# Altium schematic sheet 2_USB_Serial.SchDoc
size A3; Organization: Altium Limited; Address1: L3, 12a Rodborough Rd; Address2: Frenchs Forest; Address3: NSW; Address4: Australia 2086; SheetNumber: 2; SheetTotal: 4
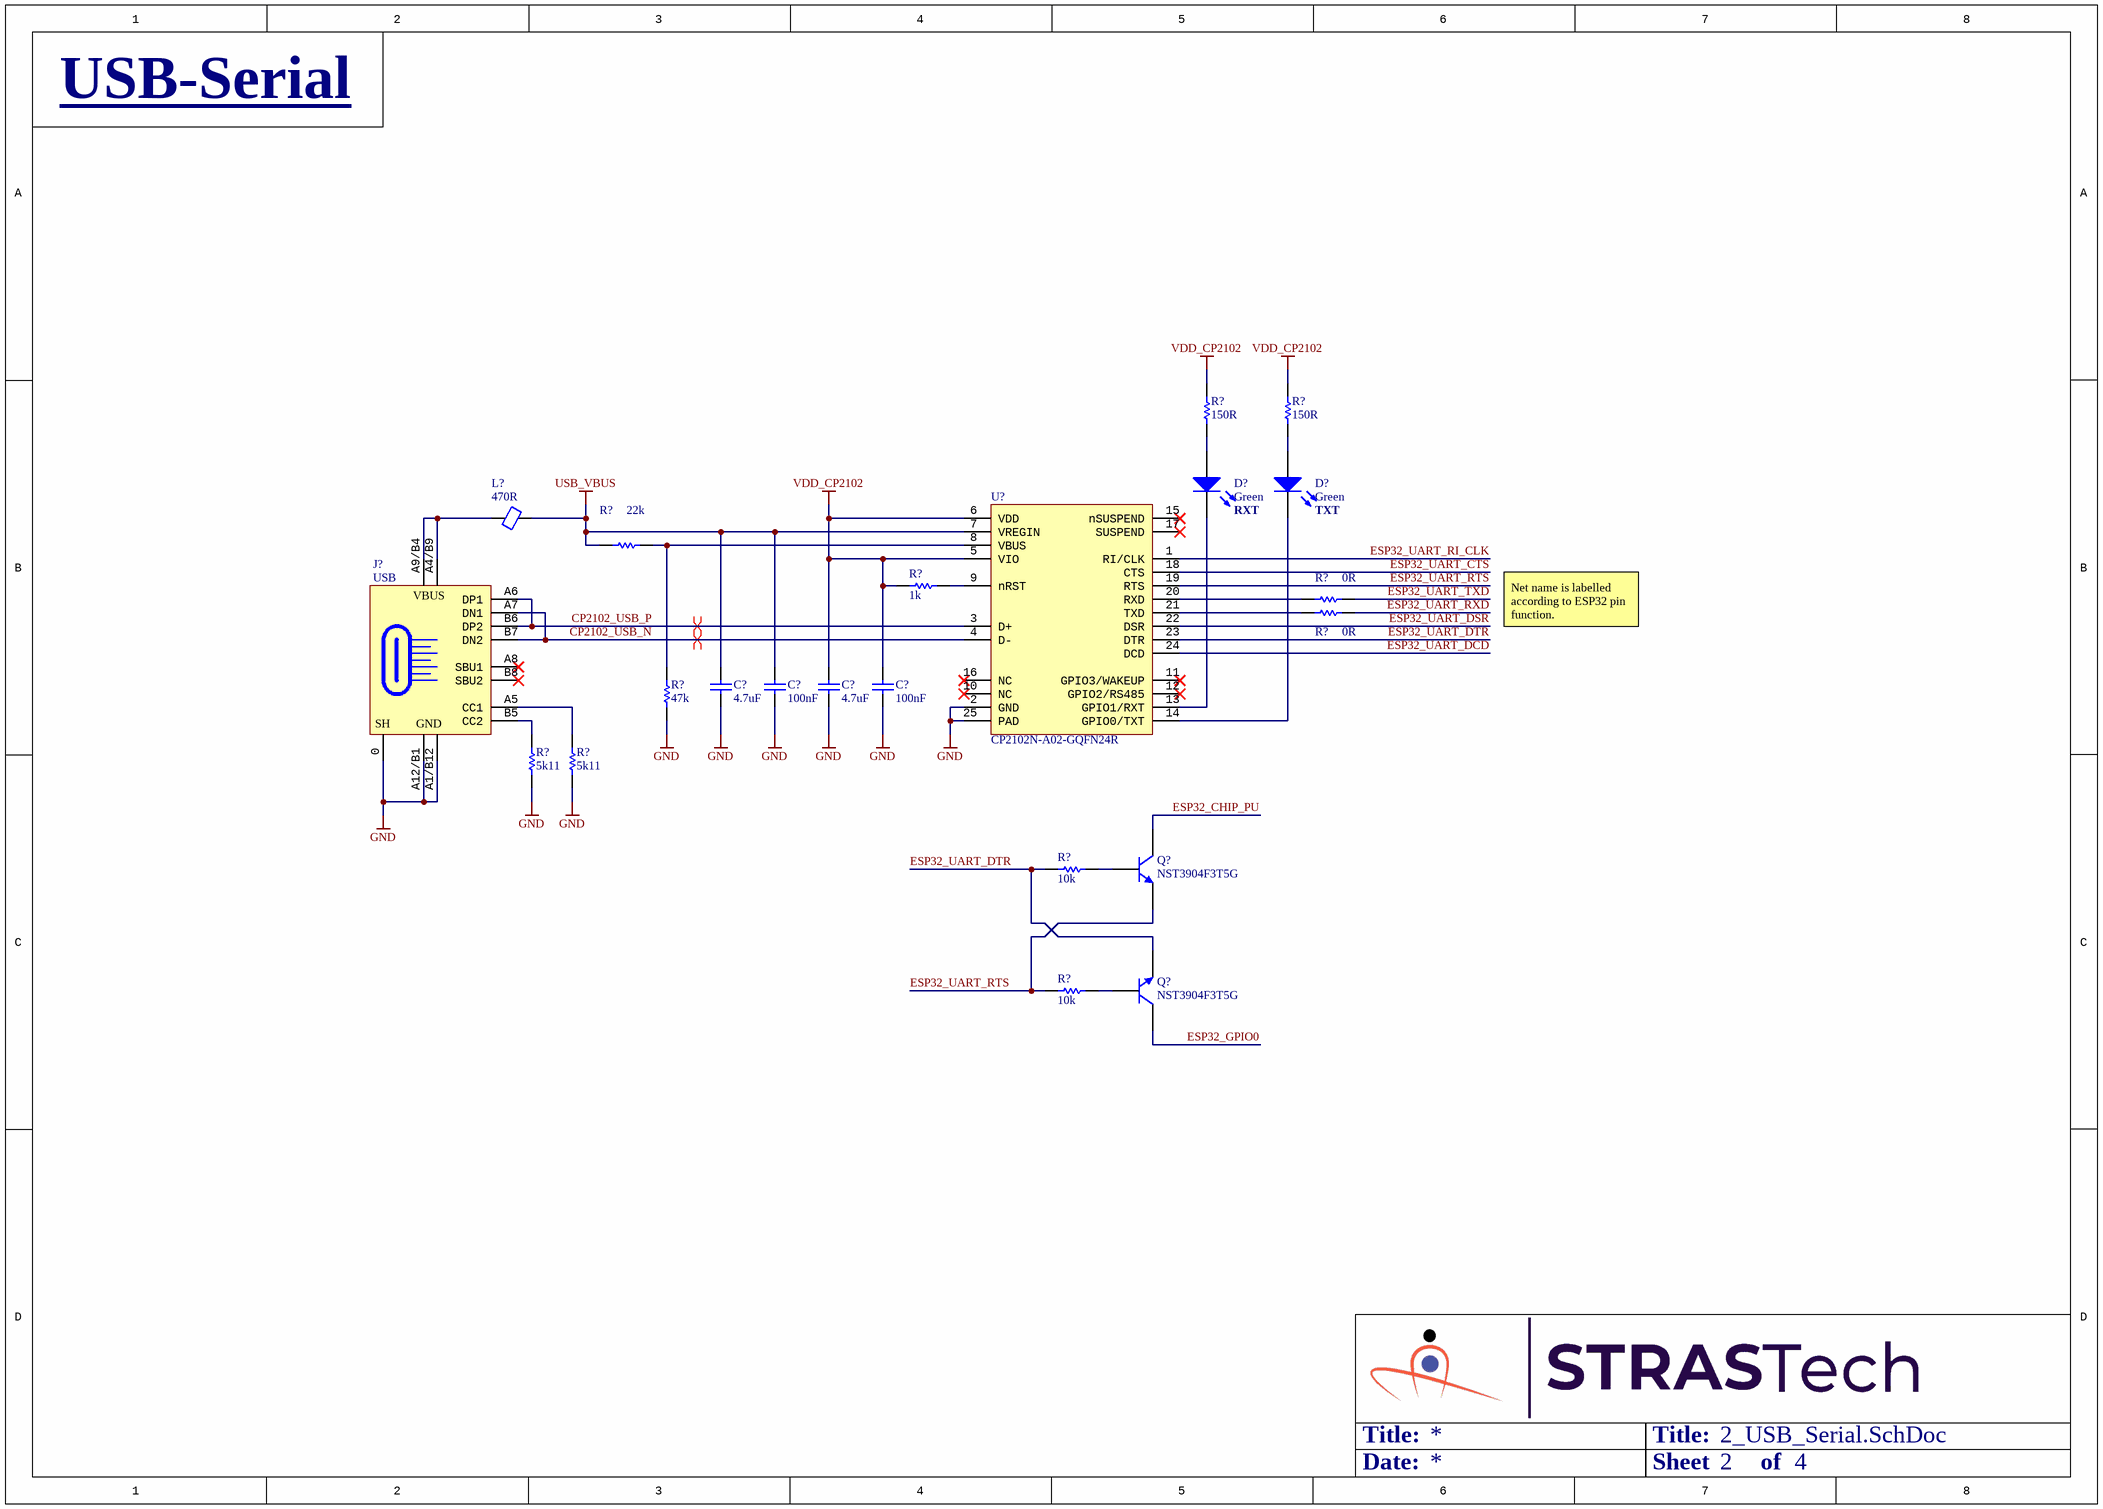
[diagram p0: 2_USB_Serial.SchDoc]

## Parts
(Parts that share a designator on the sheet are numbered #1, #2 ... from top to bottom, then left to right.)
C?#1  4.7uF  [Cap,SMD,0402]
C?#2  100nF  [Cap,SMD,0402]
C?#3  4.7uF  [Cap,SMD,0402]
C?#4  100nF  [Cap,SMD,0402]
D?#1  Green  [LED,0603]
D?#2  Green  [LED,0603]
J?  USB  [CONN,USB_C,SMD]
L?  470R  [IND,0402]
Q?#1  NST3904F3T5G  [SOT1123]
Q?#2  NST3904F3T5G  [SOT1123]
R?#1  150R  [RES,0402]
R?#2  150R  [RES,0402]
R?#3  22k  [RES,0402]
R?#4  1k  [RES,0402]
R?#5  0R  [RES,0402]
R?#6  0R  [RES,0402]
R?#7  47k  [RES,0402]
R?#8  5k11  [RES,0402]
R?#9  5k11  [RES,0402]
R?#10  10k  [RES,0402]
R?#11  10k  [RES,0402]
U?  CP2102N-A02-GQFN24R  [IC,VQFN-24,THERMAL,4x4]

## Nets
GND: C?#1.1 C?#2.1 C?#3.1 C?#4.1 J?.0(SHIELD) J?.A1/B12(GND) J?.A12/B1(GND) R?#7.1 R?#8.1 R?#9.1 U?.2(GND) U?.25(PAD)
USB_VBUS: C?#1.2 C?#2.2 L?.2 R?#3.1 U?.7(VREGIN)
VDD_CP2102: C?#3.2 C?#4.2 R?#1.2 R?#2.2 R?#4.2 U?.5(VIO) U?.6(VDD)
CP2102_USB_N: J?.A7(DN1) J?.B7(DN2) U?.4(D-)
CP2102_USB_P: J?.A6(DP1) J?.B6(DP2) U?.3(D+)
ESP32_CHIP_PU: Q?#1.3(C)
ESP32_GPIO0: Q?#2.3(C)
ESP32_UART_CTS: U?.18(CTS)
ESP32_UART_DCD: U?.24(DCD)
ESP32_UART_DSR: U?.22(DSR)
ESP32_UART_DTR: Q?#2.2(E) R?#10.2 U?.23(DTR)
ESP32_UART_RI_CLK: U?.1(RI/CLK)
ESP32_UART_RTS: Q?#1.2(E) R?#11.2 U?.19(RTS)
ESP32_UART_RXD: R?#6.2
ESP32_UART_TXD: R?#5.2
NetD?#1_1: D?#1.1(A) R?#1.1
NetD?#1_2: D?#1.2(K) U?.13(GPIO1/RXT)
NetD?#2_1: D?#2.1(A) R?#2.1
NetD?#2_2: D?#2.2(K) U?.14(GPIO0/TXT)
NetJ?_A4/B9: J?.A4/B9(VBUS) J?.A9/B4(VBUS) L?.1
NetJ?_A5: J?.A5(CC1) R?#9.2
NetJ?_B5: J?.B5(CC2) R?#8.2
NetQ?#1_1: Q?#1.1(B) R?#10.1
NetQ?#2_1: Q?#2.1(B) R?#11.1
NetR?#3_2: R?#3.2 R?#7.2 U?.8(VBUS)
NetR?#4_1: R?#4.1 U?.9(nRST)
NetR?#5_1: R?#5.1 U?.20(RXD)
NetR?#6_1: R?#6.1 U?.21(TXD)

Not connected (* = marked no-connect by the designer): J? A8(SBU1)* B8(SBU2)*; U? 10(NC)* 11(GPIO3/WAKEUP)* 12(GPIO2/RS485)* 15(nSUSPEND)* 16(NC)* 17(SUSPEND)*

## Layout directives
differential pair: CP2102_USB_N, CP2102_USB_P

## Notes on the sheet
- USB-Serial
- (near D?#1) RXT
- (near D?#2) TXT
- Net name is labelled according to ESP32 pin function.
- Title:
- Date:
- Sheet
- of
- Title
- Size:
- A3
- Revision:
- Design By:
- (in symbol Conn,USB_C,SMD) SH

## Library data of the parts
C?#1 C?#3 = CAP,Cer,4.7uF,16VDC,X5R,0402: 4.7 µF ±20% 16V Ceramic Capacitor X5R 0402 (1005 Metric); Vendor Part Number: 478-10788-1-ND; Manufacturer: AVX Corporation; Manufacturer Part Number: 0402YD475MAT2A; Vendor: Digikey; HelpURL: https://datasheets.avx.com/cx5r.pdf; CreatedBy: Judd Foster
C?#2 C?#4 = CAP,Cer,100nF,25VDC,X7R,0402: 0.1µF ±10% 25V Ceramic Capacitor X7R 0402 (1005 Metric); Vendor Part Number: 490-14603-1-ND; Manufacturer: Murata Electronics; Manufacturer Part Number: GRM155R71E104KE14J; Vendor: Digikey; HelpURL: https://search.murata.co.jp/Ceramy/image/img/A01X/G101/ENG/GRM155R71E104KE14-01.pdf; CreatedBy: Judd Foster
D?#1 D?#2 = LED,Green,SMD,0603: Green 530nm LED Indication - Discrete 3V 0603 (1608 Metric); Manufacturer: Stanley Electric Co; Manufacturer Part Number: THG1111C-0005-TR; Vendor Part Number: 404-1286-1-ND; Vendor: Digikey; CreatedBy: Judd Foster; HelpURL: http://www.stanley-components.com/php/downloaddatafile.php?rp=0,THG1111C-0005_e.pdf
J? = Conn,USB_C,SMD: USB-C (USB TYPE-C) USB 2.0 Receptacle Connector 24 (16+8 Dummy) Position Surface Mount, Right Angle; Manufacturer: GCT; Manufacturer Part Number: USB4110-GF-A; Vendor Part Number: 2073-USB4110-GF-A-1-ND; Vendor: Digikey; CreatedBy: Judd Foster; HelpURL: https://gct.co/files/drawings/usb4110.pdf
L? = Ferrite,470R@100MHz,0402: 470 Ohms @ 100 MHz 1 Power Line Ferrite Bead 0402 (1005 Metric) 1A 200mOhm; Vendor Part Number: 490-10662-1-ND; Manufacturer: Murata Electronics; Manufacturer Part Number: BLM15PX471SN1D; Vendor: Digikey; HelpURL: https://www.murata.com/en-us/products/productdata/8796740059166/ENFA0018.pdf; CreatedBy: Judd Foster
Q?#1 Q?#2 = Trans,NPN,40V,200mA,SOT1123: Bipolar (BJT) Transistor NPN 40 V 200 mA 200MHz 290 mW Surface Mount SOT-1123; Manufacturer: ON Semiconductor; Vendor Part Number: NST3904F3T5GOSCT-ND; Vendor: Digikey; CreatedBy: Judd Foster; HelpURL: https://www.onsemi.com/pdf/datasheet/nst3904f3-d.pdf; Manufacturer Part Number: NST3904F3T5G
R?#1 R?#2 = RES,150R,1%,0.1W,0402: 150 Ohms ±1% 0.063W, 1/16W Chip Resistor 0402 (1005 Metric) Automotive AEC-Q200, Moisture Resistant Thick Film; Manufacturer: TE Connectivity Passive Product; Manufacturer Part Number: CRGCQ0402F150R; Vendor Part Number: A129617CT-ND; Vendor: Digikey; CreatedBy: Judd Foster; HelpURL: https://www.te.com/commerce/DocumentDelivery/DDEController?Action=srchrtrv&DocNm=1773204-3&DocType=DS&DocLang=English
R?#3 = RES,22k,1%,0.063W,0402: 22 kOhms ±1% 0.063W, 1/16W Chip Resistor 0402 (1005 Metric) Automotive AEC-Q200 Thick Film; Vendor Part Number: RMCF0402FT22K0CT-ND; Manufacturer: Stackpole Electronics Inc; Manufacturer Part Number: RMCF0402FT22K0; Vendor: DIgikey; HelpURL: https://www.seielect.com/catalog/sei-rmcf_rmcp.pdf; CreatedBy: Judd Foster
R?#4 = RES,1k,5%,0.063W,0402: 1 kOhms ±5% 0.063W, 1/16W Chip Resistor 0402 (1005 Metric) Automotive AEC-Q200 Thick Film; Vendor Part Number: RMCF0402JT1K00CT-ND; Manufacturer: Stackpole Electronics Inc; Manufacturer Part Number: RMCF0402JT1K00; Vendor: DIgikey; HelpURL: https://www.seielect.com/catalog/sei-rmcf_rmcp.pdf; CreatedBy: Judd Foster
R?#5 R?#6 = RES,0R0,0.1W,0402: 0 Ohms Jumper 0.1W, 1/10W Chip Resistor 0402 (1005 Metric) Automotive AEC-Q200 Thick Film; Manufacturer: Panasonic Electronic Components; Manufacturer Part Number: ERJ-2GE0R00X; Vendor Part Number: P0.0JCT-ND; Vendor: Digikey; CreatedBy: Judd Foster; HelpURL: https://industrial.panasonic.com/cdbs/www-data/pdf/RDA0000/AOA0000C301.pdf
R?#7 = RES,47k,1%,0.1W,0402: 47 kOhms ±1% 0.1W, 1/10W Chip Resistor 0402 (1005 Metric) Automotive AEC-Q200 Thick Film; Manufacturer: Panasonic Electronic Components; Manufacturer Part Number: ERJ-2RKF4702X; Vendor Part Number: P47.0KLCT-ND; Vendor: Digikey; CreatedBy: Judd Foster; HelpURL: https://industrial.panasonic.com/cdbs/www-data/pdf/RDA0000/AOA0000C304.pdf
R?#8 R?#9 = RES,5k11,1%,0.063W,0402: 5.11 kOhms ±1% 0.063W, 1/16W Chip Resistor 0402 (1005 Metric) Automotive AEC-Q200, Moisture Resistant Thick Film; Manufacturer: Yageo; Manufacturer Part Number: AC0402FR-075K11L; Vendor Part Number: 13-AC0402FR-075K11LCT-ND; Vendor: Digikey; CreatedBy: Judd Foster; HelpURL: https://www.yageo.com/upload/media/product/productsearch/datasheet/rchip/PYu-AC_51_RoHS_L_7.pdf
R?#10 R?#11 = RES,10k,5%,0.063W,0402: 10 kOhms ±5% 0.063W, 1/16W Chip Resistor 0402 (1005 Metric) Automotive AEC-Q200 Thick Film; Vendor Part Number: RMCF0402JT10K0CT-ND; Manufacturer: Stackpole Electronics Inc; Manufacturer Part Number: RMCF0402JT10K0; Vendor: DIgikey; HelpURL: https://www.seielect.com/catalog/sei-rmcf_rmcp.pdf; CreatedBy: Judd Foster
U? = CP2102N-A02-GQFN24R: USB Bridge, USB to UART USB 2.0 UART Interface 24-QFN (4x4); Manufacturer: Silicon Labs; Vendor Part Number: 336-5888-1-ND; Vendor: Digikey; CreatedBy: Judd Foster; HelpURL: https://www.silabs.com/documents/public/data-sheets/cp2102n-datasheet.pdf; Manufacturer Part Number: CP2102N-A02-GQFN24R